# Altium schematic sheet Bluetooth.SchDoc: Bluetooth Module
size A4; DrawnBy: M. Small & J. Wilson; SheetNumber: 6; SheetTotal: 10
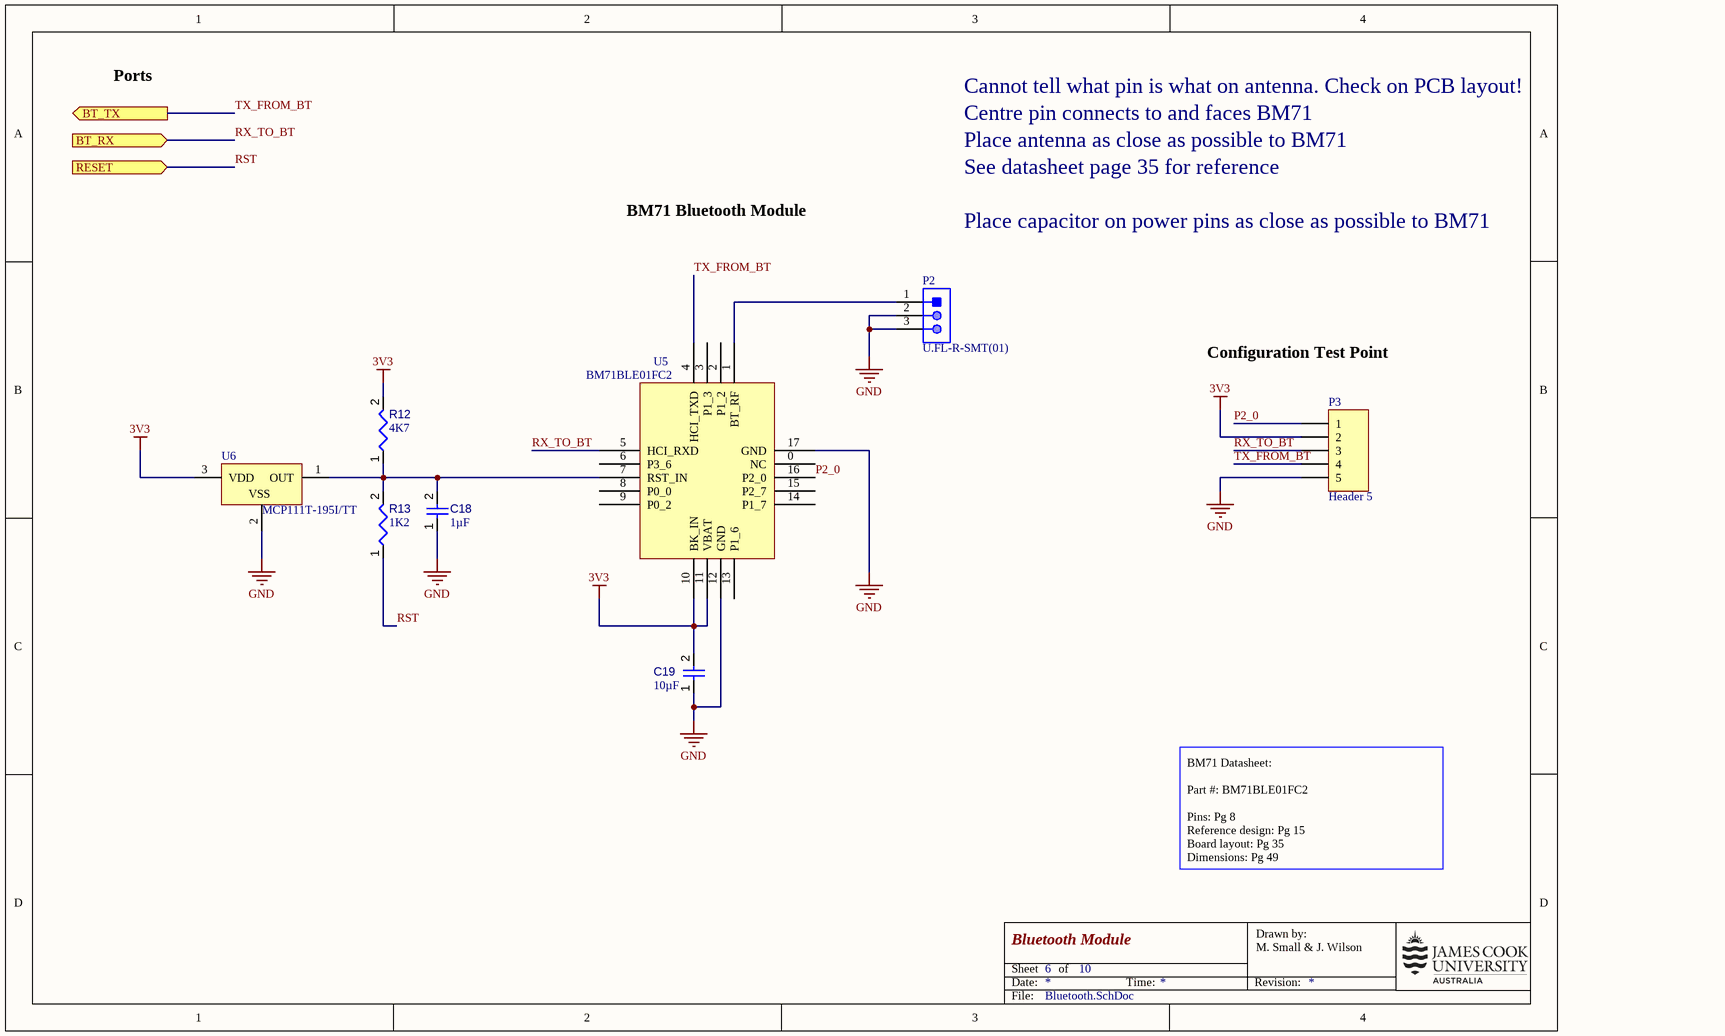
[diagram p0: Bluetooth.SchDoc]

## Parts
C18  value 1µF  [CAPC0805(2012)145_L]  (hidden comment: Capacitor 1µF +/-20% 25V 0805)
C19  value 10µF  [CAPC0805(2012)145_L]  (hidden comment: Capacitor 10µF +/-20% 25V 0805)
P2  U.FL-R-SMT(01)  [HRS-U.FL-R-SMT(10)_V]
P3  Header 5  [HDR1X5]
R12  value 4K7  [RESC0805(2012)_L]  (hidden comment: Resistor 4K7 +/-1% 0805 125 mW)
R13  1K2  [RESC0805(2012)_L]
U5  BM71BLE01FC2  [BM71BLE01FC2]
U6  MCP111T-195I/TT  [SOT-23-TT3_M]

## Ports
BT_RX (in), BT_TX (out), RESET (in)

## Nets
3V3: C19.2 P3.2 R12.2 U5.10(BK_IN) U5.11(VBAT) U6.3(VDD)
GND: C18.1 C19.1 P2.2 P2.3 P3.5 U5.12(GND) U5.17(GND) U6.2(VSS)
P2_0: P3.1 U5.16(P2_0)
RST: R13.1 ; port RESET
RX_TO_BT: P3.3 U5.5(HCI_RXD) ; port BT_RX
TX_FROM_BT: P3.4 U5.4(HCI_TXD) ; port BT_TX
NetC18_2: C18.2 R12.1 R13.2 U5.7(RST_IN) U6.1(OUT)
NetP2_1: P2.1 U5.1(BT_RF)

Not connected (* = marked no-connect by the designer): U5 0(NC) 2(P1_2) 3(P1_3) 6(P3_6) 8(P0_0) 9(P0_2) 13(P1_6) 14(P1_7) 15(P2_7)

## Notes on the sheet
- Ports
- Cannot tell what pin is what on antenna. Check on PCB layout!
- Place antenna as close as possible to BM71
- See datasheet page 35 for reference
- Centre pin connects to and faces BM71
- BM71 Bluetooth Module
- Place capacitor on power pins as close as possible to BM71
- Configuration Test Point
- BM71 Datasheet:
  Part #: BM71BLE01FC2
  Pins: Pg 8
  Reference design: Pg 15
  Board layout: Pg 35
  Dimensions: Pg 49
  Footprint: Pg 50
- Date:
- Sheet
- of
- Time:
- Revision:
- Drawn by:
- File:

## Library data of the parts
C18 = CMP-001-00079-2: Chip Capacitor, 1µF +/-20%, 25V, 0805, Thickness 1.45 mm; Tolerance: 10%; Pins: 2; Max Operating Temperature: 85°C; Mounting Technology: SMT; Case/Package: 0805; Voltage Rating: 25V; Min Operating Temperature: -55°C
C19 = CMP-001-00079-2: Chip Capacitor, 10µF +/-20%, 25V, 0805, Thickness 1.45 mm; Tolerance: 10%; Pins: 2; Max Operating Temperature: 85°C; Mounting Technology: SMT; Case/Package: 0805; Voltage Rating: 25V; Min Operating Temperature: -55°C
P2 = CMP-2000-05151-1: CONN RECPT ULTRA-MINI COAX SMD; Manufacturer: Hirose Electric; Centre Contact Resistance: 25mohm; Voltage Rating V AC: 60V; Female Contact Material: PhosphorBronze; Contact Resistance: 10mohm; Male Contact Material: Brass; Connector Type: UFLCoaxial; Connector Mounting: PCB; Impedance: 50ohm; Insulation Resistance: 500Mohm; Secondary Insulation Material: PBT; Frequency Max: 6GHz; Body Plating: Silver; External Length / Height: 2.5mm; Approval Category: UL94V-0; Female Contact Plating: Gold; Connector Mounting Orientation: PCBoard; VSWR: 1.3; Coaxial Termination: Solder; Body Style: StraightJack; SVHC: NoSVHC(18-Jun-2012); Jacket Material: LCP; Package Reference: U.FL-R-SMT(10); Datasheet Version: Feb-04; Outer Contact Resistance: 10mohm; Contact Plating: Gold; Mounting Type: PCBoard; Flammability Rating: UL94V-0; Operating Frequency Max: 6GHz; Termination Method: Solder; Male Contact Plating: Gold; Package Description: 3-Pin Surface Mount Device, Body 2.6 x 2.6 mm; Operating Temperature Min: -40degC; Manufacturer URL: https://www.hirose.com; Operating Temperature Max: 90degC; Contact Material: PhosphorBronze; Datasheet URL: http://www.farnell.com/datasheets/91524.pdf; Material: PhosphorBronze
P3 = Header 5: Header, 5-Pin; LatestRevisionDate: 17-Jul-2002; LatestRevisionNote: Re-released for DXP Platform.; Publisher: Altium Limited
R12 = CMP-009-00118-2: Chip Resistor, 4.7kOhms, +/-1%, 125 mW, -55 to 155 degC, 0805; Power: 125mW; Tolerance: 1%; Max Operating Temperature: 155°C; Min Operating Temperature: -55°C; Pins: 2; Case/Package: 0805
R13 = CMP-009-00076-1: 1K2 0.125W 5% 0805 (2012 Metric)  SMD; Mounting Technology: SMT; Power: 0.125W; Value: 1K2; Pins: 2; Case/Package: 0805; Tolerance: 5%
U5 = BM71BLE01FC2: Microchip BM71BLE01FC2 Bluetooth Low Energy (BLE) Module; Datasheet: https://au.mouser.com/datasheet/2/268/Bluetooth_Low_Energy_BLE_Module_DS60001372K-2257931.pdf
U6 = CMP-0130-00051-1: 1.75Î¼A Micropower Voltage Detector, Open-Drain Output, 1.90V, 3-Pin SOT-23, Industrial Temperature, Tape and Reel; PackageDescription: 3-Lead Plastic Small Outline Transistor (TT) [SOT-23]; DatasheetVersion: revD, Jun-2005; PackageVersion: revBB, Aug-2009; Code_IPC: SOT23-3; PackageReference: SOT-23-TT3